# Altium schematic sheet Nixie_2.SchDoc
size A4; SheetNumber: 5; SheetTotal: 7
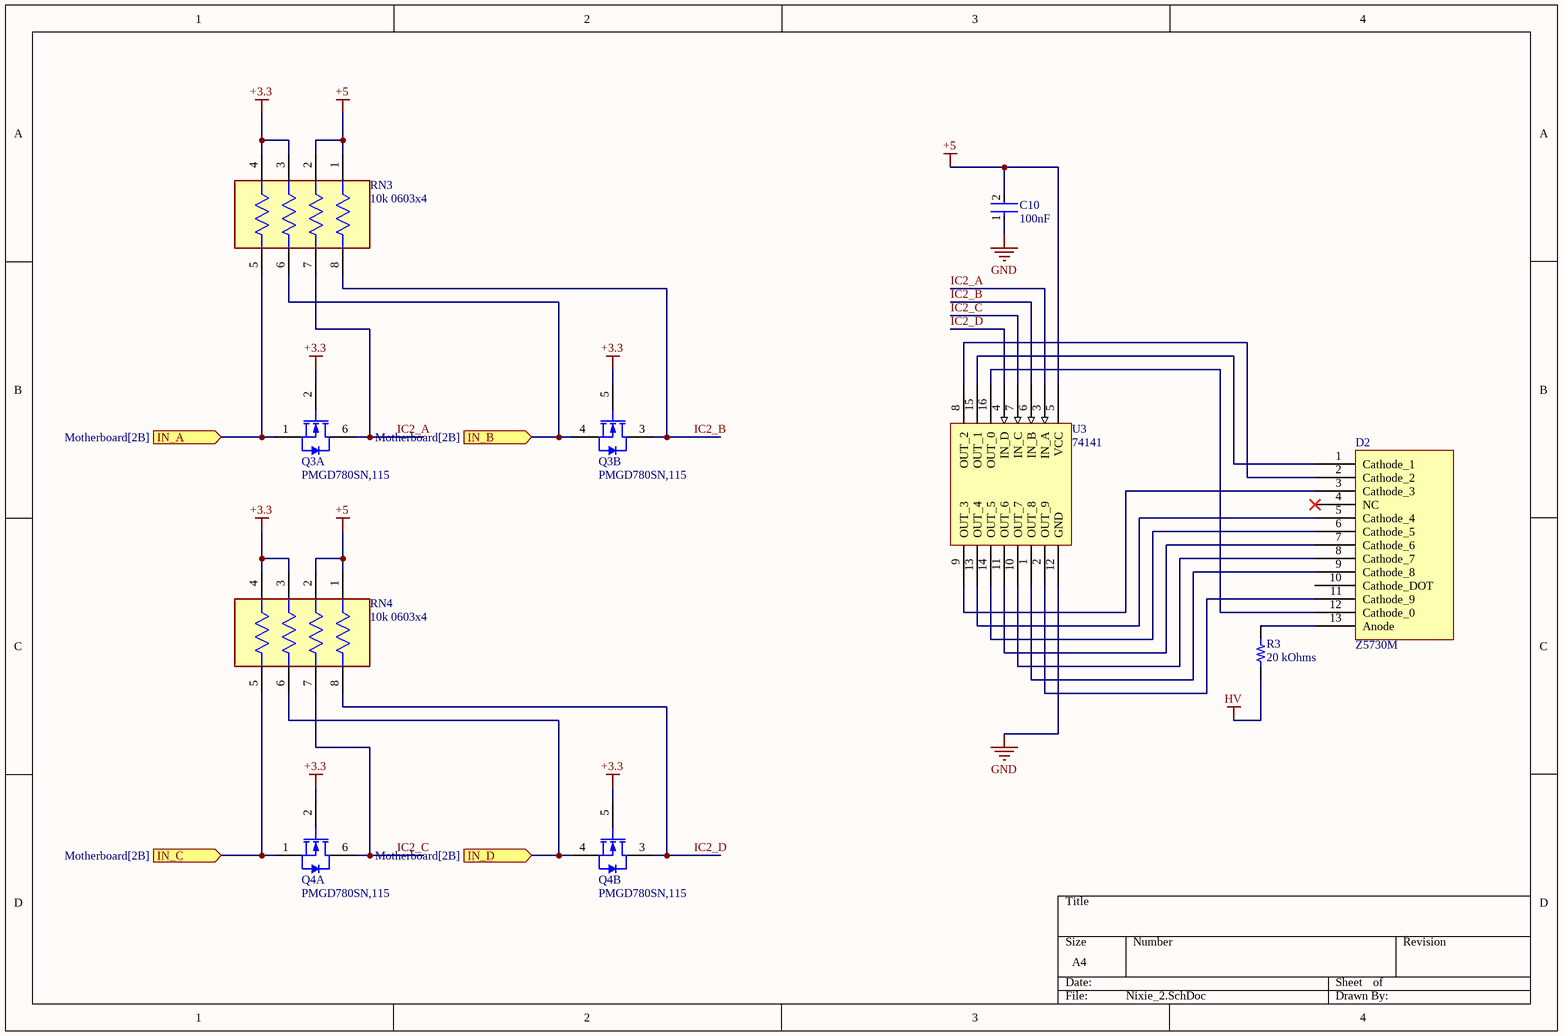
[diagram p0: Nixie_2.SchDoc]

## Parts
C10  100nF  [FP-C1005-050-0_15-MFG]
D2  Z5730M  [Z5730M]
Q3  PMGD780SN,115  [NXP-SOT363_N]  (parts A,B of 2)
Q4  PMGD780SN,115  [NXP-SOT363_N]  (parts A,B of 2)
R3  20 kOhms  [RES 1210_3225]
RN3  10k 0603x4  [FP-EXB38V-MFG]
RN4  10k 0603x4  [FP-EXB38V-MFG]
U3  74141  [DIP-16]

## Ports
IN_A (in, see Motherboard[2B]), IN_B (in, see Motherboard[2B]), IN_C (in, see Motherboard[2B]), IN_D (in, see Motherboard[2B])

## Nets
+3.3: Q3.2(G1) Q3.5(G2) Q4.2(G1) Q4.5(G2) RN3.3 RN3.4 RN4.3 RN4.4
+5: C10.2 RN3.1 RN3.2 RN4.1 RN4.2 U3.5(VCC)
GND: C10.1 U3.12(GND)
HV: R3.1
IC2_A: Q3.6(D1) RN3.7 U3.3(IN_A)
IC2_B: Q3.3(D2) RN3.8 U3.6(IN_B)
IC2_C: Q4.6(D1) RN4.7 U3.7(IN_C)
IC2_D: Q4.3(D2) RN4.8 U3.4(IN_D)
IN_A: Q3.1(S1) RN3.5 ; port IN_A
IN_B: Q3.4(S2) RN3.6 ; port IN_B
IN_C: Q4.1(S1) RN4.5 ; port IN_C
IN_D: Q4.4(S2) RN4.6 ; port IN_D
NetD2_1: D2.1(Cathode_1) U3.15(OUT_1)
NetD2_2: D2.2(Cathode_2) U3.8(OUT_2)
NetD2_3: D2.3(Cathode_3) U3.9(OUT_3)
NetD2_5: D2.5(Cathode_4) U3.13(OUT_4)
NetD2_6: D2.6(Cathode_5) U3.14(OUT_5)
NetD2_7: D2.7(Cathode_6) U3.11(OUT_6)
NetD2_8: D2.8(Cathode_7) U3.10(OUT_7)
NetD2_9: D2.9(Cathode_8) U3.1(OUT_8)
NetD2_11: D2.11(Cathode_9) U3.2(OUT_9)
NetD2_12: D2.12(Cathode_0) U3.16(OUT_0)
NetD2_13: D2.13(Anode) R3.2

Not connected (* = marked no-connect by the designer): D2 4(NC)* 10(Cathode_DOT)

## Library data of the parts
C10 = CMP-2000-05438-2: CAP CER 100nF 10V X5R 0402; Dielectric Material: Ceramic; Tolerance: 20%; Capacitance: 4.7uF; RoHS Compliant: Yes; Lead Free: Lead Free; Max Operating Temperature: 85°C; Case Code (Metric): 1005; Dielectric: X5R; Height: 0.5mm; Length: 1mm; Case Code (Imperial): 0402; Width: 0.02inch; Mount: Surface Mount; Case/Package: 0402; Min Operating Temperature: -55°C; Radiation Hardening: No; Resistor Type: Ceramic; Construction: Flat; REACH SVHC: No SVHC; Voltage Rating (DC): 10V; Voltage Rating: 10V; Package Quantity: 1; Termination: SMD/SMT; Thickness: 500um; Voltage: 10V; Packaging: Tape and Reel; Depth: 0.5mm; Weight: 2.3E-05oz; Series: C
Q3 Q4 = CMP-1258-00177-1: Dual N-Channel uTrenchMOS Standard Level FET, 60 V, 0.49 A, 6-Pin SOT363, Tape and Reel; Manufacturer: NXP Semiconductors; ID [max] (A): 0.49; Packing: Tape & Reel; Channel Type: N; Coss [typ] (pF): 5; VDS [max] (V): 60; VGSth [typ] (V): 2; Ciss [typ] (pF): 23; ComponentLink1Description: Manufacturer URL; ComponentLink2Description: Datasheet; ComponentLink2URL: http://www.nxp.com/documents/data_sheet/PMGD780SN.pdf; PackageReference: SOT363; PartNumber: PMGD780SN,115; Mounting Technology: Surface Mount; DatasheetVersion: Rev. 02; PackageDescription: 6-Pin Small Outline Transistor Package, Body 2 x 1.25 mm, Pitch 0.65 mm; ComponentLink3Description: Package Specification; Code_JEITA: SC-88; ComponentLink1URL: http://www.nxp.com/; ComponentLink3URL: http://www.nxp.com/documents/outline_drawing/sot363_po.pdf; PackageVersion: 06-03-16, 03/2006
R3 = CRCW121020K0FKEAHP: RES SMD 20K OHM 1% 3/4W 1210; Manufacturer: Vishay Dale; Power (Watts): 0.75W, 3/4W; Temperature Coefficient: ±100ppm/°C; Part Number: CRCW121020K0FKEAHP; ComponentLink1Description: Datasheet; ComponentLink1URL: http://www.vishay.com/docs/20043/crcwhpe3.pdf; ComponentLink2Description: DigiKey Link; ComponentLink2URL: http://digikey.com/product-detail/en/vishay-dale/CRCW121020K0FKEAHP/541-20.0KDCT-ND/2567330; Composition: Thick Film; Device Package: 1210 (3225 Metric); Features: Automotive AEC-Q200, Pulse Withstanding; Height - Seated (Max): 0.028" (0.70mm); LastUpdated: 27.03.2023 20:03:38; Lifecycle Status: Active; Minimum Order: 1; Number of Terminations: 2; Operating Temperature: -55°C ~ 155°C; Package / Case: 1210 (3225 Metric); Packaging: TapeAndReel; Part Status: Active; Price: 0.07; Ratings: AEC-Q200; Resistance: 20 kOhms; Series: CRCW-HP; Size / Dimension: 0.126" L x 0.098" W (3.20mm x 2.50mm); Supplier 1: DigiKey; Supplier Part Number 1: 541-20.0KDCT-ND; Supplier Device Package: 1210; Tolerance: ±1%; Value: 20 kOhms
RN3 RN4 = CMP-2000-05314-2: RES ARRAY 4 RES 10K OHM 1206 / RC-ML08W103JT; Number of Terminals/Pins: 8; Number of Elements: 4; Tolerance: 5%; Resistance: 10kR; Temperature Coefficient: 200ppm/°C; Power Per Element: 62.5mW; Voltage Rating (DC): 100V; Circuit Type: Isolated; Power Dissipation: 63mW; Voltage Rating: 50V; Max Operating Temperature: 125°C; Terminal Pitch: 0.8mm; Mount: Surface Mount; Width: 1.6mm; Military Standard: Not; Length: 3.2mm; Lead Free: Lead Free; Case Code (Imperial): 1206; Packaging: Tape and Reel; Height: 0.5mm; Package Quantity: 1; Number of Resistors: 4; Depth: 1.6mm; Number of Contacts: 8; Number of Pins: 8; Series: EXB; Min Operating Temperature: -55°C; Case Code (Metric): 3216; Case/Package: 1206; Radiation Hardening: No; Termination: Convex; Resistance Tolerance: 5%; RoHS Compliant: Yes; Size Code: 0603; Contact Plating: Tin; Technology: THICK FILM